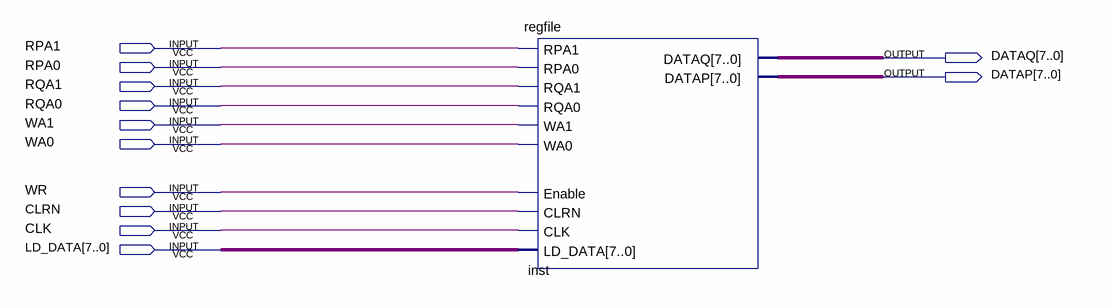
[diagram p0: schematic sheet]
// Quartus schematic registerfile.bdf as structural Verilog: 1 symbols, 12 pins
module registerfile (
  input  RPA1,
  input  RPA0,
  input  RQA1,
  input  RQA0,
  input  WA1,
  input  WA0,
  input  WR,
  input  CLRN,
  input  CLK,
  input  [7:0] LD_DATA,
  output [7:0] DATAQ,
  output [7:0] DATAP
);

  regfile inst (
    .LD_DATA(LD_DATA), .CLK(CLK), .WA0(WA0), .WA1(WA1), .Enable(WR), .CLRN(CLRN), .RQA0(RQA0), .RPA0(RPA0),
    .RQA1(RQA1), .RPA1(RPA1), .DATAQ(DATAQ), .DATAP(DATAP));
endmodule
